# Altium schematic sheet SHT_7_I_Calibration_07349-R5_L10.SchDoc
size B; CompanyName: Microchip Technology Inc.; Organization: Microchip Technology; Address1: 2355 West Chandler Blvd.; Address2: Chandler, AZ  85224; Address4: USA; SheetNumber: 6; SheetTotal: 9; SheetTitle: Current Measurement Calibration; Time: Time
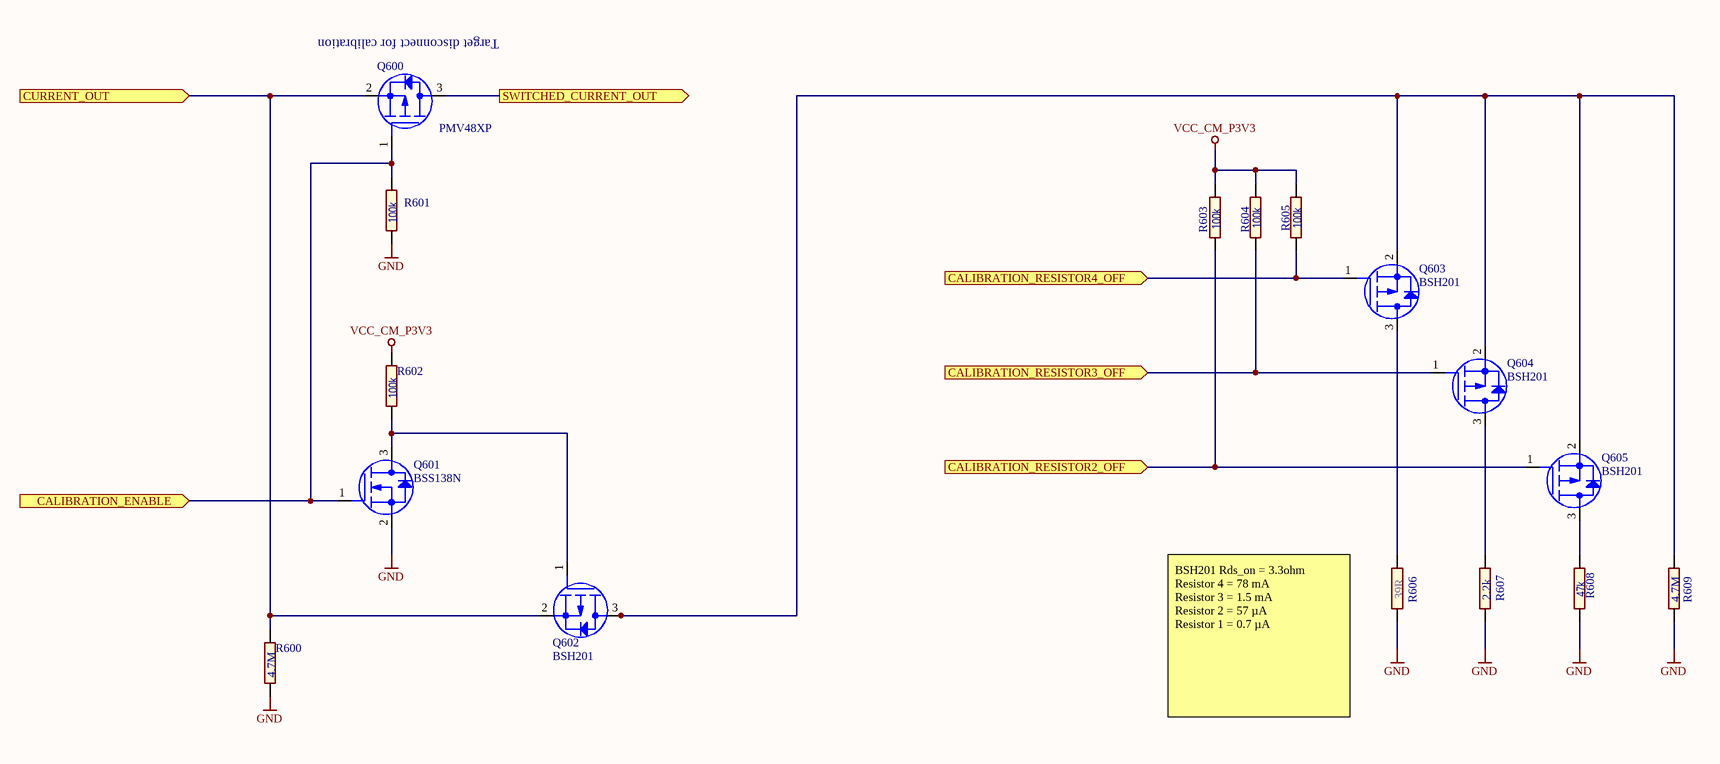
[diagram p0: SHT_7_I_Calibration_07349-R5_L10.SchDoc]

## Parts
?  (no value)  (graphical)
Q600  value PMV48XP  [AP5-00002]
Q601  value BSS138N  [AP5-00002]
Q602  value BSH201  [AP5-00002]
Q603  value BSH201  [AP5-00002]
Q604  value BSH201  [AP5-00002]
Q605  value BSH201  [AP5-00002]
R600  value 4.7M  [AP2-00011]
R601  value 100k  [AP2-00011]
R602  value 100k  [AP2-00011]
R603  value 100k  [AP2-00011]
R604  value 100k  [AP2-00011]
R605  value 100k  [AP2-00011]
R606  value 39R  [AP2-00011]
R607  value 2.2k  [AP2-00011]
R608  value 47k  [AP2-00011]
R609  value 4.7M  [AP2-00011]

## Ports
CALIBRATION_ENABLE (in), CALIBRATION_RESISTOR2_OFF (in), CALIBRATION_RESISTOR3_OFF (in), CALIBRATION_RESISTOR4_OFF (in), CURRENT_OUT (in), SWITCHED_CURRENT_OUT (out)

## Nets
GND: Q601.2(S) R600.1 R601.1 R606.1 R607.1 R608.1 R609.1
VCC_CM_P3V3: R602.2 R603.2 R604.2 R605.2
CALIBRATION_ENABLE: Q600.1(G) Q601.1(G) R601.2 ; port CALIBRATION_ENABLE
CALIBRATION_RESISTOR2_OFF: Q605.1(G) R603.1 ; port CALIBRATION_RESISTOR2_OFF
CALIBRATION_RESISTOR3_OFF: Q604.1(G) R604.1 ; port CALIBRATION_RESISTOR3_OFF
CALIBRATION_RESISTOR4_OFF: Q603.1(G) R605.1 ; port CALIBRATION_RESISTOR4_OFF
CURRENT_OUT: Q600.2(S) Q602.2(S) R600.2 ; port CURRENT_OUT
SWITCHED_CURRENT_OUT: Q600.3(D) ; port SWITCHED_CURRENT_OUT
NetQ601_3: Q601.3(D) Q602.1(G) R602.1
NetQ602_3: Q602.3(D) Q603.2(S) Q604.2(S) Q605.2(S) R609.2
NetQ603_3: Q603.3(D) R606.2
NetQ604_3: Q604.3(D) R607.2
NetQ605_3: Q605.3(D) R608.2

## Notes on the sheet
- (near Q600) Target disconnect for calibration
- (near R606) BSH201 Rds_on = 3.3ohm
  Resistor 4 = 78 mA
  Resistor 3 = 1.5 mA
  Resistor 2 = 57 µA
  Resistor 1 = 0.7 µA
- Drawn By:
- Engineer:
- PartNumber:
- Project Title
- Sheet Title
- Size
- B
- Revision:
- Sch #:
- Date:
- Sheet
- Designed with
- Altium.com <http://go.altium.com/MicrochipLandingPage_Evaluation.html>
- File:

## Library data of the parts
? = Title Block B
Q600 = A05-0130: P-Channel Digital FET. -30V, -3.5A continuous, -14A Peak. RDS(ON)=48mOhm@VGS=-4.5V, RDS(ON)=71mOhm@VGS=-2.5V. VGS(th)<1.25V; PartGroup: Transistors,Power FET,SMD; Manufacturer: NXP; MPN: PMV48XP,215; TemperatureRange: -55Â°C to +150Â°C; ComponentStatus: 'Active (verified)'; Status: New; AN: A05-0130; FootprintStatus: 'Active (Verified)'
Q601 = A05-0140: Low leakage N-Channel MOSFET. 60V, 0.23A continuous, 0.92A Peak. RDS(ON) = 3.5Ohm@VGS=4.5V, VGS(th)<1.4V; PartGroup: Transistors,Small signal FET,SMD; Manufacturer: Infineon; TemperatureRange: -55  to +150 deg celcius; ComponentStatus: 'Active (verified)'; Status: New; AN: A05-0140; Height: 1.10000002384186; MPN: BSS138N; FootprintStatus: 'Active (Verified)'
Q602-Q605 = A05-0132: P-Channel Digital FET. -60V, -0.3A continuous, -1.2A Peak. RDS(ON)=2.5@VGS=-10V, RDS(ON)=<5 ohm @VGS=-2.5V. VGS(th)<1.9V; PartGroup: Transistors,Small signal FET,SMD; Manufacturer: NXP; MPN: BSH201,215; ComponentStatus: 'Active (verified)'; Status: New; AN: A05-0132; FootprintStatus: 'Active (Verified)'
R600 R609 = A02-0884: Thick film SMD 0402 1/16W 1%; PartGroup: Resistors,SMD,0402 1%; Manufacturer: YAGEO CORP; MPN: RC0402FR-074M7L; TemperatureRange: -55 Â°C to +155 Â°C; ComponentStatus: 'Active (verified)'; Status: Active; Verified by: Lars Helge Mo; Verified date: 2005-12-19; AN: A02-0884; Tolerance: 1 %; FootprintStatus: 'Active (Verified)'
R601-R605 = A02-0260: Thick film resistor, SMD 0402, 1/16W, 1%; PartGroup: Resistors,SMD,0402 1%; Manufacturer: ASJ; MPN: CR10-1003-FK; TemperatureRange: -55ï¿½ to +125ï¿½C; ComponentStatus: 'Active (verified)'; Status: Active; Verified by: Lars Helge Mo; Verified date: 2005-12-19; AN: A02-0260; Tolerance: 1 %; Height: 0.349999994039536; FootprintStatus: 'Active (Verified)'
R606 = A02-0178: Thick film resistor, SMD 0402, 1/16W, 1%; PartGroup: Resistors,SMD,0402 1%; MPN: CR10-39R0-FK; Manufacturer: ASJ; TemperatureRange: -55 - +125 deg C; ComponentStatus: 'Active (verified)'; Status: Active; Verified by: Lars Helge Mo; Verified date: 2005-12-19; AN: A02-0178; Tolerance: 1 %; Height: 0.349999994039536; FootprintStatus: 'Active (Verified)'
R607 = A02-0220: Thick film resistor, SMD 0402, 1/16W, 1%; PartGroup: Resistors,SMD,0402 1%; Manufacturer: YAGEO CORP; MPN: RC0402FR-072K2L; TemperatureRange: -55 - +125 deg C; ComponentStatus: 'Active (verified)'; Status: Active; Verified by: Lars Helge Mo; Verified date: 2005-12-19; AN: A02-0220; Tolerance: 1 %; Height: 0.349999994039536; FootprintStatus: 'Active (Verified)'
R608 = A02-0252: Thick film resistor, SMD 0402, 1/16W, 1%; PartGroup: Resistors,SMD,0402 1%; Manufacturer: KOA; MPN: RK73H1ETTP4702F; TemperatureRange: -55 - +125 deg C; ComponentStatus: 'Active (verified)'; Status: Active; Verified by: Lars Helge Mo; Verified date: 2005-12-19; AN: A02-0252; Tolerance: 1 %; Height: 0.349999994039536; FootprintStatus: 'Active (Verified)'